# EAGLE design OPA1622 - Buffer (EAGLE 6.4)
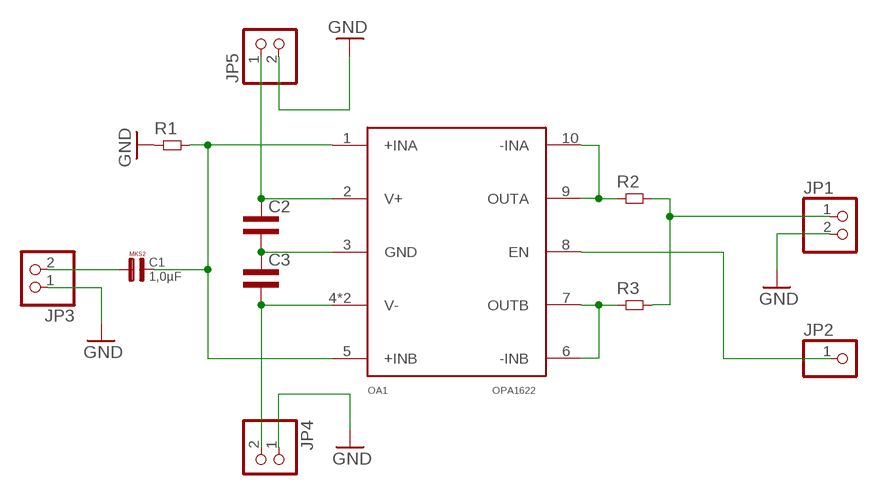
[diagram p0: schematic, sheet 1]

## Parts
C1  1,0µF  [R5B5]
C2  CAP0603L3  [0603L3]
C3  CAP0603L3  [0603L3]
JP1  PINHD-1X2  [1X02]
JP2  PINHD-1X1  [1X01]
JP3  PINHD-1X2  [1X02]
JP4  PINHD-1X2  [1X02]
JP5  PINHD-1X2  [1X02]
OA1  OPA1622  [S-PVSON-N10]
R1  RES0603L3  [0603L3]
R2  RES0805L3  [0805L3]
R3  RES0805L3  [0805L3]

## Nets
GND: JP1.2 JP3.1 JP4.1 JP5.2 R1.P$1
N$1: OA1.9(OUTA) OA1.10(-INA) R2.1
N$2: OA1.6(-INB) OA1.7(OUTB) R3.1
N$3: JP1.1 R2.2 R3.2
N$5: C1.1 JP3.2
N$6: C2.P$2 C3.P$1 OA1.3(GND)
N$7: C3.P$2 JP4.2 OA1.4(V-) OA1.TP(V-)
N$8: C2.P$1 JP5.1 OA1.2(V+)
N$10: JP2.1 OA1.8(EN)
N$11: C1.2 OA1.1(+INA) OA1.5(+INB) R1.P$2

## Library data of the parts
C1 = Capacitor-Wima-MKS2-63v:1,0µF
C2 C3 = common:CAP
JP1 JP3-JP5 = pinhead:PINHD-1X2: PIN HEADER
JP2 = pinhead:PINHD-1X1: PIN HEADER
OA1 = common:OPA1622
R1-R3 = common:RES

## Board
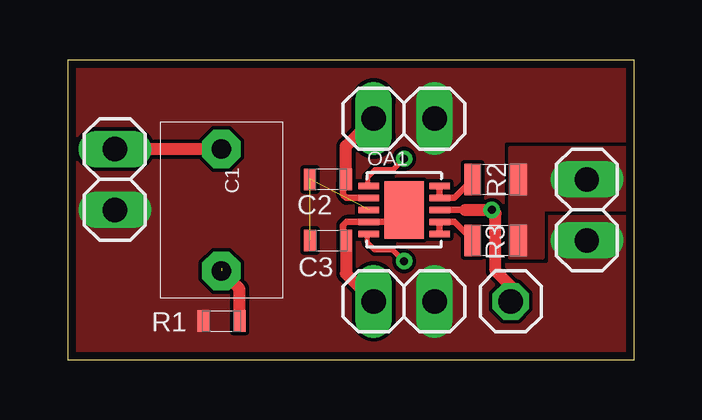
[diagram p1: board, top side]
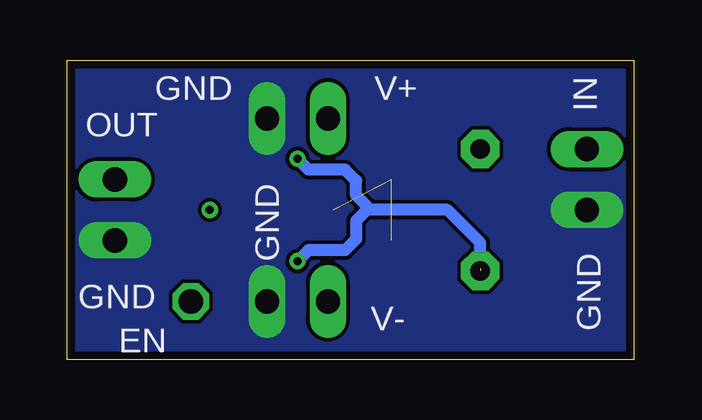
[diagram p2: board, bottom side, seen from below]

Size 23.62 x 12.5 mm. Coordinates in mm from the lower left corner, seen from the top.
Outline: 0,12.5 0,0 23.62,0 23.62,12.5 0,12.5
Copper layers (1*16): Top 0.035mm / dielectric 1.5mm / Bottom 0.035mm
Design rules "default *": minimum track width 6mil, minimum drill 13mil, track to track 6mil, track to pad 6mil, pad to pad 6mil, via to via 6mil, smd to smd 6mil, copper to edge 13mil, drill to drill 8mil, minimum pad ring 7mil, minimum via ring 7mil, stop-mask expansion 4mil, vias tented up to drill 0mil, thermal gap 10mil

### Footprints (pad centres in the part's own frame; a part is rotated, then mirrored left to right if it is on the bottom)
R5B5 = drill 0.813 pad 1.6 octagon: 1 -2.54,0; 2 2.54,0
0603L3 = smd 0.5 x 0.9: P$1 -0.75,0; P$2 0.75,0
1X02 = drill 1.016 long: 1 -1.27,0; 2 1.27,0
1X01 = drill 1.016 octagon: 1 0,0
S-PVSON-N10 = smd 0.28 x 0.85: 1 -1,-1.475; 2 -0.5,-1.475; 3 0,-1.475; 4 0.5,-1.475; 5 1,-1.475; 6 1,1.475; 7 0.5,1.475; 8 0,1.475; 9 -0.5,1.475; 10 -1,1.475 | smd 2.4 x 1.65: TP 0,0
0805L3 = smd 0.7 x 1.3: 1 -0.95,0; 2 0.95,0

### Placement (x,y rotation side)
C1  6.4,6.25 270 top
C2  10.85,7.52 180 top
C3  10.85,4.98 0 top
JP1  21.64,6.25 270 top
JP2  18.47,2.44 270 top
JP3  1.96,7.52 90 top
JP4  14.02,2.44 180 top
JP5  14.02,10.06 0 top
OA1  14.02,6.25 270 top
R1  6.4,1.63 0 top
R2  17.83,7.52 0 top
R3  17.83,4.98 0 top

### Tracks (layer width: path | path; a pad name or v marks a point on that pad's centre or on a via)
GND
  pour Bottom (rank 6, no thermals): 23.32,12.19 23.32,0.3 0.3,0.3 0.3,12.19
  pour Top (rank 6, no thermals): 23.32,12.19 23.32,0.3 0.3,0.3 0.3,12.19
N$1
  Top 0.279: R2.1 16.11,6.75 OA1.9 OA1.10
N$2
  Top 0.279: R3.1 16.11,5.75 OA1.7 OA1.6
N$3
  pour Top (no thermals): 18.44,4.27 18.44,8.84 23.32,8.84 23.32,6.25 19.81,6.25 19.81,4.27
N$5
  Top 0.508: C1.1 JP3.2
N$6  (2 unrouted)
N$7
  Top 0.279: C3.P$2 11.48,5.09 11.48,5.61 11.62,5.75 OA1.4 13.52,5.75 OA1.TP
  Top 0.508: C3.P$2 11.6,3.59 JP4.2
N$8
  Top 0.279: OA1.2 11.62,6.75 11.48,6.88 11.48,7.4 C2.P$1
  Top 0.508: C2.P$1 11.6,8.9 JP5.1
N$10  (via drill 0.33)
  Top 0.279: OA1.8 16.56,6.25
  Top 0.508: 16.56,6.25 v17.68,6.25 17.83,6.1 17.83,3.71 18.47,3.07 JP2.1
N$11  (via drill 0.33)  (1 unrouted)
  Top 0.203: v14.02,8.38 13.56,7.92 12.8,7.92 12.5,7.62 12.5,7.3 OA1.1 | v14.02,4.11 13.56,4.57 12.8,4.57 12.5,4.88 12.5,5.2 OA1.5
  Top 0.508: R1.P$2 7.15,2.96 C1.2
  Bottom 0.508: 6.4,3.81 6.4,4.88 7.77,6.25 11.12,6.25 | 11.12,6.25 11.58,5.79 11.58,5.03 12.04,4.57 13.56,4.57 v14.02,4.11 | 11.12,6.25 11.12,6.4 11.58,6.86 11.58,7.47 12.04,7.92 13.56,7.92 v14.02,8.38

### Text on the board
bPlace: V+ | GND | IN | OUT | GND | GND | GND | V- | EN